# Altium schematic sheet LDO.SchDoc
size A4; SheetNumber: 3; SheetTotal: 6
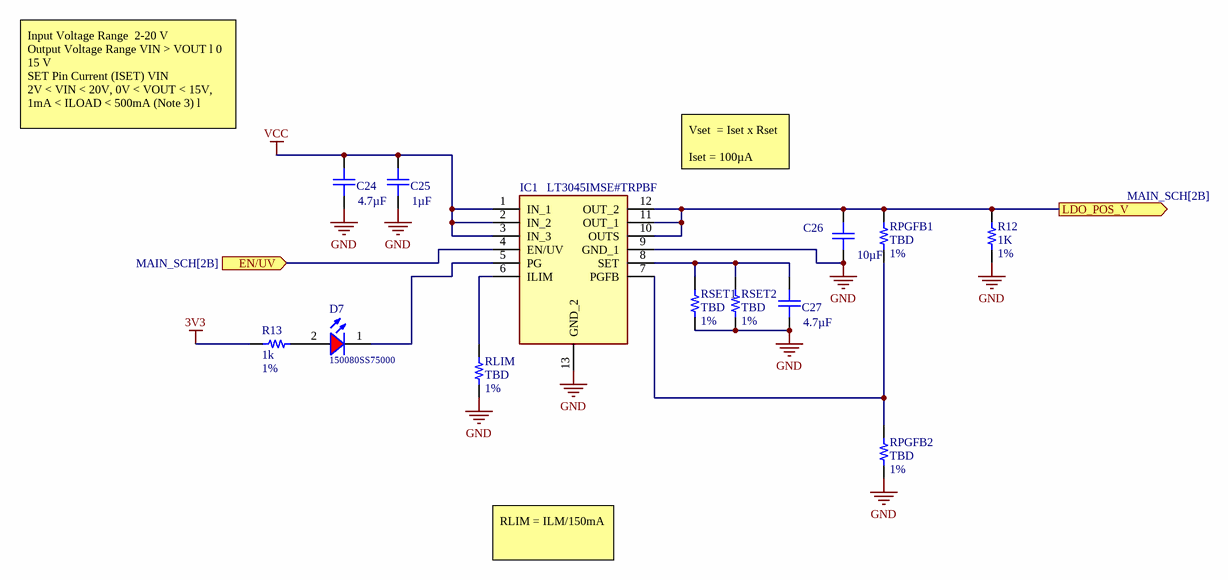
[diagram p0: LDO.SchDoc]

## Parts
C24  value 4.7µF  [FP-CL10-IPC_B]  (hidden comment: Capacitor)
C25  value 1µF  [FP-CL10-IPC_B]  (hidden comment: Capacitor)
C26  value 10µF  [FP-CL10-IPC_B]  (hidden comment: Capacitor)
C27  value 4.7µF  [FP-CL10-IPC_B]  (hidden comment: Capacitor)
D7  150080SS75000  [WL-SMCW_0805]
IC1  LT3045IMSE#TRPBF  [SOP65P490X110-13N]
R12  value 1K  Tolerance: 1%  [RESC1608X06N 0603 Medium Density]  (hidden comment: RC0603FR-071KL)
R13  value 1k  Tolerance: 1%  [RESC1608X06N 0603 Medium Density]  (hidden comment: RC0603FR-071KL)
RLIM  value TBD  Tolerance: 1%  [RESC1608X06N 0603 Medium Density]  (hidden comment: RC0603FR-071KL)
RPGFB1  value TBD  Tolerance: 1%  [RESC1608X06N 0603 Medium Density]  (hidden comment: RC0603FR-071KL)
RPGFB2  value TBD  Tolerance: 1%  [RESC1608X06N 0603 Medium Density]  (hidden comment: RC0603FR-071KL)
RSET1  value TBD  Tolerance: 1%  [RESC1608X06N 0603 Medium Density]  (hidden comment: RC0603FR-071KL)
RSET2  value TBD  Tolerance: 1%  [RESC1608X06N 0603 Medium Density]  (hidden comment: RC0603FR-071KL)

## Ports
EN/UV (in, see MAIN_SCH[2B]), LDO_POS_V (out, see MAIN_SCH[2B])

## Nets
3V3: R13.2
GND: C24.1 C25.1 C26.1 C27.1 IC1.9(GND_1) IC1.13(GND_2) R12.2 RLIM.2 RPGFB2.2 RSET1.2 RSET2.2
VCC: C24.2 C25.2 IC1.1(IN_1) IC1.2(IN_2) IC1.3(IN_3)
EN/UV: IC1.4(EN/UV) ; port EN/UV
LDO_POS_V: C26.2 IC1.10(OUTS) IC1.11(OUT_1) IC1.12(OUT_2) R12.1 RPGFB1.1 ; port LDO_POS_V
NetC27_2: C27.2 IC1.8(SET) RSET1.1 RSET2.1
NetD7_1: D7.1(K) IC1.5(PG)
NetD7_2: D7.2(A) R13.1
NetIC1_6: IC1.6(ILIM) RLIM.1
NetIC1_7: IC1.7(PGFB) RPGFB1.2 RPGFB2.1

## Notes on the sheet
- Input Voltage Range  2-20 V
  Output Voltage Range VIN > VOUT l 0 15 V
  SET Pin Current (ISET) VIN
  2V < VIN < 20V, 0V < VOUT < 15V, 1mA < ILOAD < 500mA (Note 3) l
- Vset  = Iset x Rset
  Iset = 100µA
- RLIM = ILM/150mA
- Title
- Size:
- Date:
- A4
- Designer:
- Time:
- Sheet
- Revision:
- of
- University of Stuttgart
- ILH
- Pfaffenwaldring 47
- 70569 Stuttgart
- Germany
- File:

## Library data of the parts
C24-C27 = CMP-024-000000-16: SMT Capacitor; Design Item ID: Capacitor; Source: Passives.SchLib
D7 = CMP-027-000004-2: WL-SMCW SMT Mono-color Chip LED Waterclear, size 0805, Super Red, 1.9V, 140deg; Peak Wavelength typ.: 645nm; Chip Technology: AlInGaP; Dominant Wavelength typ.: 630nm; Luminous Intensity typ.: 60mcd; Operating Temperature: -40 to +85degC; Design Item ID: 150080SS75000; Size: 0805; Packaging: Tape and Reel; Emitting Color: Super Red; ComponentLink1URL: http://www.we-online.de; Part Number: 150080SS75000; Published Date: December 2019; ComponentLink2Description: Datasheet; ComponentLink2URL: https://www.we-online.com/catalog/datasheet/150080SS75000.pdf; Source: WL-SMCW_0805.SchLib; ComponentLink1Description: Manufacturer; Viewing Angle: 140deg; Forward Voltage typ.: 1.9V; Publisher: Wurth Elektronik; Mounting Technology: SMT
IC1 = LT3045IMSE#TRPBF: LDO Voltage Regulators 20V, 500mA, Ultralow Noise, Ultrahigh PSRR Linear Regulator; Manufacturer_Name: Analog Devices; Geometry.Height: 1.1mm; Mouser Part Number: 584-LT3045IMSE#TRPBF; Mouser Price/Stock: https://www.mouser.co.uk/ProductDetail/Analog-Devices/LT3045IMSETRPBF?qs=oahfZPh6IAI8jiLw9gdaFw%3D%3D; Manufacturer_Part_Number: LT3045IMSE#TRPBF; Datasheet Link: https://www.arrow.com/en/products/lt3045imsetrpbf/analog-devices
R12 R13 RLIM RPGFB1 RPGFB2 RSET1 RSET2 = CMP-009-00006-14: RES SMD 1K OHM 1% 1/10W 0603; Temperature Coefficient: 100ppm/°C; Power: 100mW; Voltage Rating: 75V; JLCPCB Part #: C21190; Min Operating Temperature: -55°C; RoHS Compliant: Yes; Height: 0.45mm; Max Operating Temperature: 155°C; Depth: 0.8mm; Pins: 2; Case/Package: 0603; Length: 1.6mm; Mounting Technology: Surface Mount